# Altium schematic sheet SheetCircuitInputPowerModule220V.SchDoc
size 420 x 297 mm; Address1: Address1; Address2: Address2; Address3: Address3; Address4: Address4; SheetNumber: 1; Scale: 1:1; Разраб.: Лепотенко А.С.; Обозначение документа: CE.420322.001 Э3; Наименование организации: Systems Electronic; Перв. применение: CE.420322.000; Наименование изделия 1: Модуль входной 220В; Наименование изделия 2: Схема электрическая; Наименование изделия 3: принципиальная; Нач. отд.: Нач. отд.
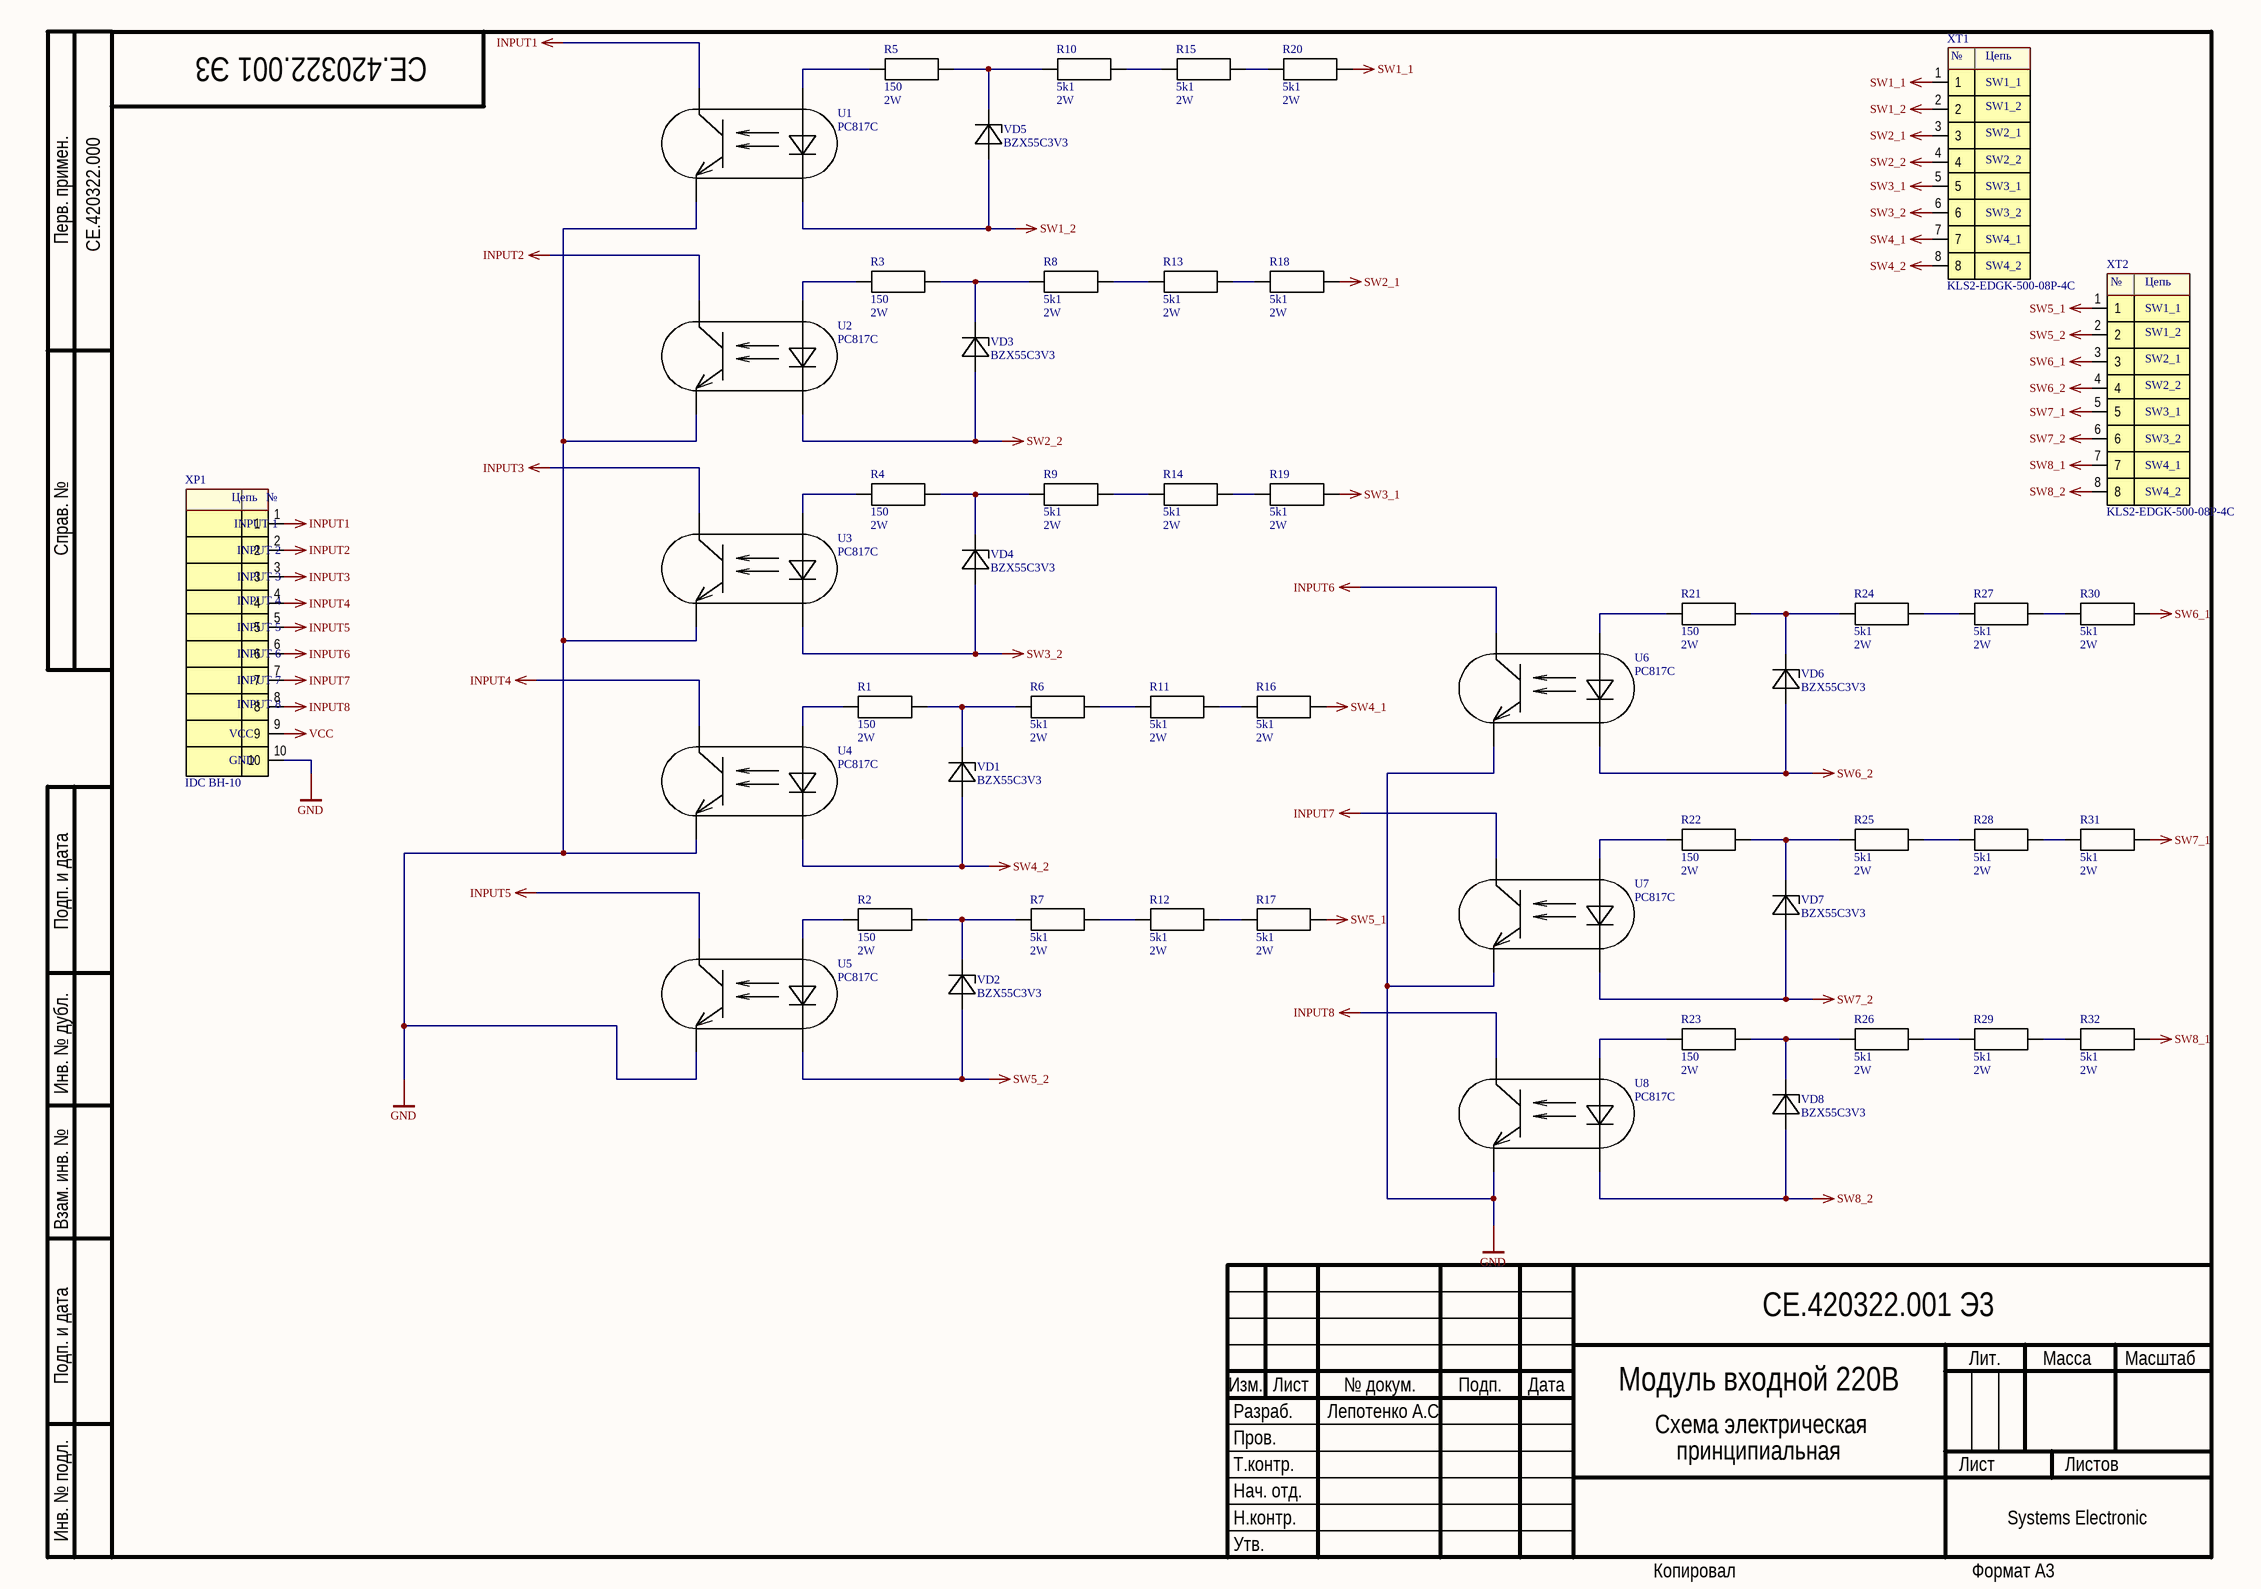
[diagram p0: SheetCircuitInputPowerModule220V.SchDoc]

## Parts
R1  value 150  Power: 2W  [MOF-2W-15x5]  (hidden comment: CFR02WJ0151P5)
R2  value 150  Power: 2W  [MOF-2W-15x5]  (hidden comment: CFR02WJ0151P5)
R3  value 150  Power: 2W  [MOF-2W-15x5]  (hidden comment: CFR02WJ0151P5)
R4  value 150  Power: 2W  [MOF-2W-15x5]  (hidden comment: CFR02WJ0151P5)
R5  value 150  Power: 2W  [MOF-2W-15x5]  (hidden comment: CFR02WJ0151P5)
R6  value 5k1  Power: 2W  [MOF-2W-15x5]  (hidden comment: CFR02WJ0512P5)
R7  value 5k1  Power: 2W  [MOF-2W-15x5]  (hidden comment: CFR02WJ0512P5)
R8  value 5k1  Power: 2W  [MOF-2W-15x5]  (hidden comment: CFR02WJ0512P5)
R9  value 5k1  Power: 2W  [MOF-2W-15x5]  (hidden comment: CFR02WJ0512P5)
R10  value 5k1  Power: 2W  [MOF-2W-15x5]  (hidden comment: CFR02WJ0512P5)
R11  value 5k1  Power: 2W  [MOF-2W-15x5]  (hidden comment: CFR02WJ0512P5)
R12  value 5k1  Power: 2W  [MOF-2W-15x5]  (hidden comment: CFR02WJ0512P5)
R13  value 5k1  Power: 2W  [MOF-2W-15x5]  (hidden comment: CFR02WJ0512P5)
R14  value 5k1  Power: 2W  [MOF-2W-15x5]  (hidden comment: CFR02WJ0512P5)
R15  value 5k1  Power: 2W  [MOF-2W-15x5]  (hidden comment: CFR02WJ0512P5)
R16  value 5k1  Power: 2W  [MOF-2W-15x5]  (hidden comment: CFR02WJ0512P5)
R17  value 5k1  Power: 2W  [MOF-2W-15x5]  (hidden comment: CFR02WJ0512P5)
R18  value 5k1  Power: 2W  [MOF-2W-15x5]  (hidden comment: CFR02WJ0512P5)
R19  value 5k1  Power: 2W  [MOF-2W-15x5]  (hidden comment: CFR02WJ0512P5)
R20  value 5k1  Power: 2W  [MOF-2W-15x5]  (hidden comment: CFR02WJ0512P5)
R21  value 150  Power: 2W  [MOF-2W-15x5]  (hidden comment: CFR02WJ0151P5)
R22  value 150  Power: 2W  [MOF-2W-15x5]  (hidden comment: CFR02WJ0151P5)
R23  value 150  Power: 2W  [MOF-2W-15x5]  (hidden comment: CFR02WJ0151P5)
R24  value 5k1  Power: 2W  [MOF-2W-15x5]  (hidden comment: CFR02WJ0512P5)
R25  value 5k1  Power: 2W  [MOF-2W-15x5]  (hidden comment: CFR02WJ0512P5)
R26  value 5k1  Power: 2W  [MOF-2W-15x5]  (hidden comment: CFR02WJ0512P5)
R27  value 5k1  Power: 2W  [MOF-2W-15x5]  (hidden comment: CFR02WJ0512P5)
R28  value 5k1  Power: 2W  [MOF-2W-15x5]  (hidden comment: CFR02WJ0512P5)
R29  value 5k1  Power: 2W  [MOF-2W-15x5]  (hidden comment: CFR02WJ0512P5)
R30  value 5k1  Power: 2W  [MOF-2W-15x5]  (hidden comment: CFR02WJ0512P5)
R31  value 5k1  Power: 2W  [MOF-2W-15x5]  (hidden comment: CFR02WJ0512P5)
R32  value 5k1  Power: 2W  [MOF-2W-15x5]  (hidden comment: CFR02WJ0512P5)
U1  PC817C  [DIP-4M]
U2  PC817C  [DIP-4M]
U3  PC817C  [DIP-4M]
U4  PC817C  [DIP-4M]
U5  PC817C  [DIP-4M]
U6  PC817C  [DIP-4M]
U7  PC817C  [DIP-4M]
U8  PC817C  [DIP-4M]
VD1  BZX55C3V3  [DO-35]
VD2  BZX55C3V3  [DO-35]
VD3  BZX55C3V3  [DO-35]
VD4  BZX55C3V3  [DO-35]
VD5  BZX55C3V3  [DO-35]
VD6  BZX55C3V3  [DO-35]
VD7  BZX55C3V3  [DO-35]
VD8  BZX55C3V3  [DO-35]
XP1  IDC BH-10  [IDC-10-2]
XT1  KLS2-EDGK-500-08P-4C  [KLS2-EDR-500-8P]
XT2  KLS2-EDGK-500-08P-4C  [KLS2-EDR-500-8P]

## Nets
GND: U1.3 U2.3 U3.3 U4.3 U5.3 U6.3 U7.3 U8.3 XP1.10
INPUT1: U1.4 XP1.1
INPUT2: U2.4 XP1.2
INPUT3: U3.4 XP1.3
INPUT4: U4.4 XP1.4
INPUT5: U5.4 XP1.5
INPUT6: U6.4 XP1.6
INPUT7: U7.4 XP1.7
INPUT8: U8.4 XP1.8
SW1_1: R20.2 XT1.1
SW1_2: U1.2 VD5.1 XT1.2
SW2_1: R18.2 XT1.3
SW2_2: U2.2 VD3.1 XT1.4
SW3_1: R19.2 XT1.5
SW3_2: U3.2 VD4.1 XT1.6
SW4_1: R16.2 XT1.7
SW4_2: U4.2 VD1.1 XT1.8
SW5_1: R17.2 XT2.1
SW5_2: U5.2 VD2.1 XT2.2
SW6_1: R30.2 XT2.3
SW6_2: U6.2 VD6.1 XT2.4
SW7_1: R31.2 XT2.5
SW7_2: U7.2 VD7.1 XT2.6
SW8_1: R32.2 XT2.7
SW8_2: U8.2 VD8.1 XT2.8
VCC: XP1.9
NetR1_1: R1.1 U4.1
NetR1_2: R1.2 R6.1 VD1.2
NetR2_1: R2.1 U5.1
NetR2_2: R2.2 R7.1 VD2.2
NetR3_1: R3.1 U2.1
NetR3_2: R3.2 R8.1 VD3.2
NetR4_1: R4.1 U3.1
NetR4_2: R4.2 R9.1 VD4.2
NetR5_1: R5.1 U1.1
NetR5_2: R5.2 R10.1 VD5.2
NetR6_2: R6.2 R11.1
NetR7_2: R7.2 R12.1
NetR8_2: R8.2 R13.1
NetR9_2: R9.2 R14.1
NetR10_2: R10.2 R15.1
NetR11_2: R11.2 R16.1
NetR12_2: R12.2 R17.1
NetR13_2: R13.2 R18.1
NetR14_2: R14.2 R19.1
NetR15_2: R15.2 R20.1
NetR21_1: R21.1 U6.1
NetR21_2: R21.2 R24.1 VD6.2
NetR22_1: R22.1 U7.1
NetR22_2: R22.2 R25.1 VD7.2
NetR23_1: R23.1 U8.1
NetR23_2: R23.2 R26.1 VD8.2
NetR24_2: R24.2 R27.1
NetR25_2: R25.2 R28.1
NetR26_2: R26.2 R29.1
NetR27_2: R27.2 R30.1
NetR28_2: R28.2 R31.1
NetR29_2: R29.2 R32.1

## Notes on the sheet
- Перв. примен.
- Справ. №
- Подп. и дата
- Инв. № дубл.
- Взам. инв. №
- Разраб.
- Изм.
- Лист
- № докум.
- Подп.
- Дата
- Лит.
- Масса
- Масштаб
- Пров.
- Т.контр.
- Листов
- Инв. № подл.
- Утв.
- Н.контр.
- Копировал
- Формат А3
- (in symbol KLS2-EDGK-500-08P-4C) №; Цепь; SW1_1; SW1_2; SW2_1; SW2_2; SW3_1; SW3_2; SW4_1; SW4_2
- (in symbol Разъем IDC BH-10) Цепь; №; INPUT 1; INPUT 2; INPUT 3; INPUT 4; INPUT 5; INPUT 6; INPUT 7; INPUT 8; VCC; GND

## Library data of the parts
R1-R32 = Resistor: Manufacturer: Royal Ohm; Quntity: 24; Price: 0.05; Package: AXELPackage
  R1-R5 R21-R23: Part Number: CFR02WJ0151P5; SHoppingPlace: http://belchip.by/product/?selected_product=08041
  R6-R20 R24-R32: Part Number: CFR02WJ0512P5; SHoppingPlace: http://belchip.by/product/?selected_product=05907
U1-U8 = PC817: Manufacturer: SHARP; Part Number: PC817C; Price: 0.15; ShoppingPlace: http://belchip.by/product/?selected_product=29779; Package: DIP-4; Quantity: 8; Value: *
VD1-VD8 = Stabilitron: Manufacturer: DC Components; Part Number: BZX55C3V3; Value: *; Package: DO-35; ShoppingPlace: http://belchip.by/product/?selected_product=01814; Quantity: 16; Price: 0.025
XP1 = Разъем IDC BH-10: Manufacturer: RUICHI; Part Number: IDC BH-10; Value: *; Price: 0.22; ShoppingPlace: http://belchip.by/product/?selected_product=01919; Quantity: 1
XT1 XT2 = KLS2-EDGK-500-08P-4C: Manufacturer: KLS; Part Number: KLS2-EDGK-500-08P-4C; Price: 0.55; ShoppingPlace: http://belchip.by/product/?selected_product=19113; Quantity: 2; Value: *